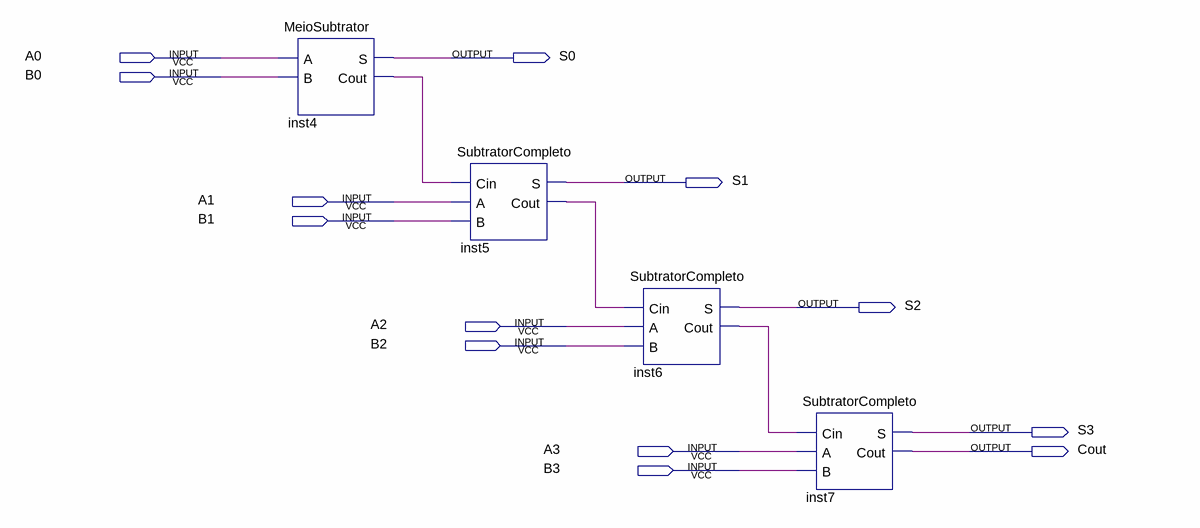
[diagram p0: schematic sheet]
// Quartus schematic SubtratorDe4Bits.bdf as structural Verilog: 4 symbols, 13 pins
module SubtratorDe4Bits (
  input  A0,
  input  B0,
  input  A1,
  input  B1,
  input  A2,
  input  B2,
  input  A3,
  input  B3,
  output S0,
  output S1,
  output S2,
  output S3,
  output Cout
);

  wire inst4_cout, inst5_cout, inst6_cout;

  MeioSubtrator inst4 (.A(A0), .B(B0), .S(S0), .Cout(inst4_cout));
  SubtratorCompleto inst5 (.Cin(inst4_cout), .A(A1), .B(B1), .S(S1), .Cout(inst5_cout));
  SubtratorCompleto inst6 (.Cin(inst5_cout), .A(A2), .B(B2), .S(S2), .Cout(inst6_cout));
  SubtratorCompleto inst7 (.Cin(inst6_cout), .A(A3), .B(B3), .S(S3), .Cout(Cout));
endmodule
